# EAGLE design MPPT_Charger_12A (EAGLE 7.6.0)

## Sheet 1 of 2
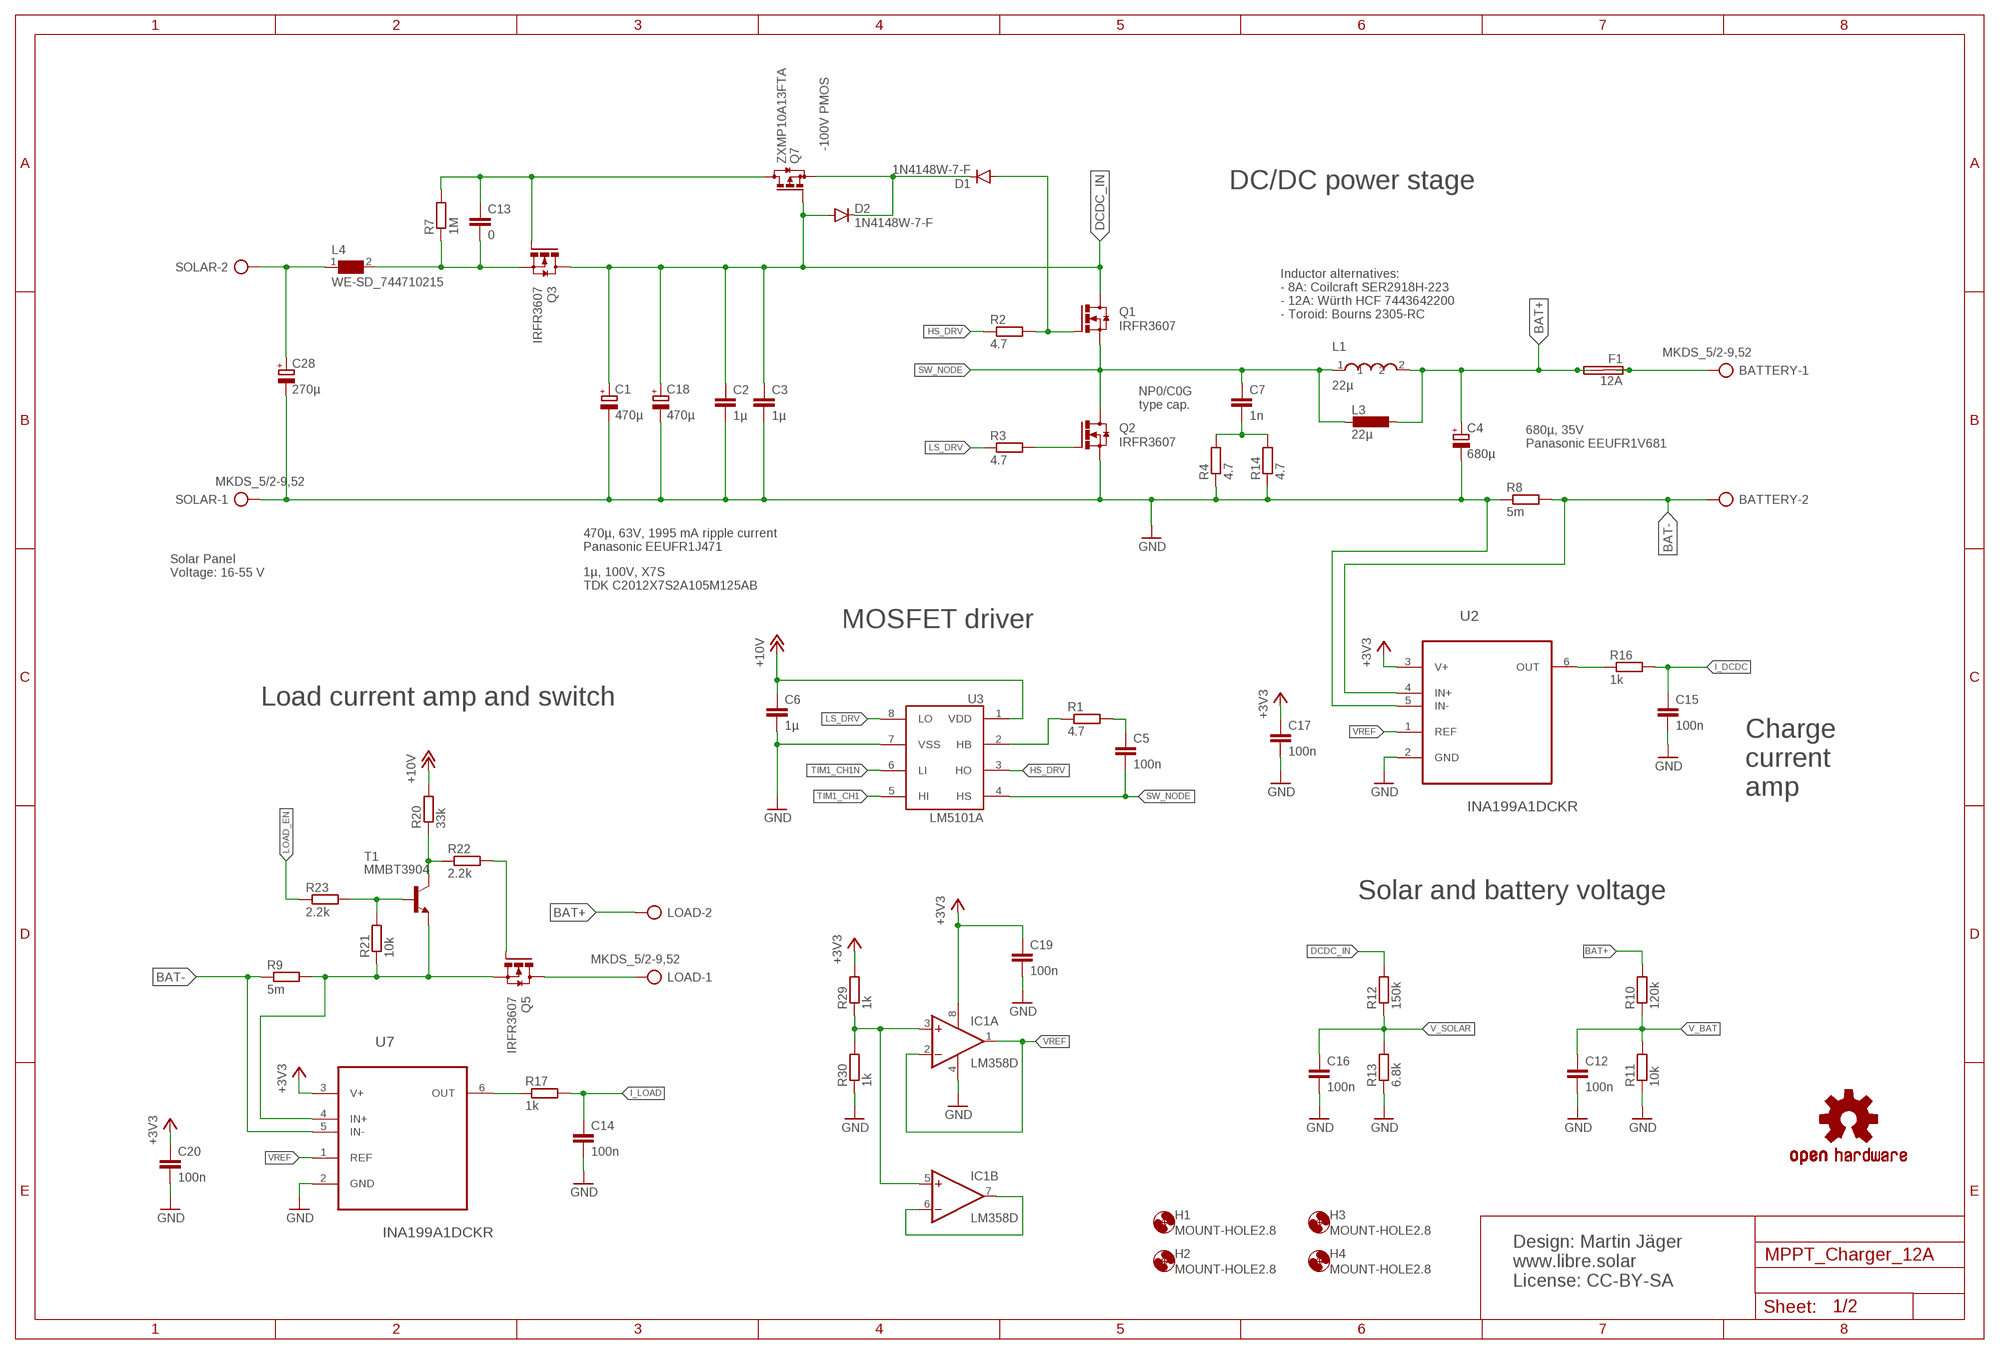
[diagram p0: schematic, sheet 1]

### Parts
BATTERY  MKDS_5/2-9,52  [MKDS_5/2-952]
C1  470µ  CPOL-EUE5-13  [E5-13]
C2  1µ  C-EUC0805  [C0805]
C3  1µ  C-EUC0805  [C0805]
C4  680µ  CPOL-EUE5-10.5  [E5-10,5]
C5  100n  C-EUC0603  [C0603]
C6  1µ  C-EUC0603  [C0603]
C7  1n  C-EUC0805  [C0805]
C12  100n  C-EUC0603  [C0603]
C13  0  C-EUC0603  [C0603]
C14  100n  C-EUC0603  [C0603]
C15  100n  C-EUC0603  [C0603]
C16  100n  C-EUC0603  [C0603]
C17  100n  C-EUC0603  [C0603]
C18  470µ  CPOL-EUE5-13  [E5-13]
C19  100n  C-EUC0603  [C0603]
C20  100n  C-EUC0603  [C0603]
C28  270µ  CPOL-EUE5-10.5  [E5-10,5]
D1  1N4148W-7-F  DIODESOD123  [SOD-123]
D2  1N4148W-7-F  DIODESOD123  [SOD-123]
F1  12A  FUSE_BLADE_STD  [BLADE_FUSE_STD]
H1  MOUNT-HOLE2.8  [2,8]
H2  MOUNT-HOLE2.8  [2,8]
H3  MOUNT-HOLE2.8  [2,8]
H4  MOUNT-HOLE2.8  [2,8]
IC1  LM358D  [SO08]
L1  22µ  WE-HCF_2818_7443643300  [WE-HCF_2818_7443643300]
L3  22µ  L-BOURNS2300-H  [L-BOURNS-2300-H]
L4  WE-SD_744710215  [WE-SD_744710215]
LOAD  MKDS_5/2-9,52  [MKDS_5/2-952]
N1  OSHW-LOGOM  [OSHW-LOGO-M]
Q1  IRFR3607  MOSFET_N_DPAK  [DPAK]
Q2  IRFR3607  MOSFET_N_DPAK  [DPAK]
Q3  IRFR3607  MOSFET_N_DPAK  [DPAK]
Q5  IRFR3607  MOSFET_N_DPAK  [DPAK]
Q7  ZXMP10A13FTA  BSS84  [SOT23]
R1  4.7  R-EU_R0805  [R0805]
R2  4.7  R-EU_R0805  [R0805]
R3  4.7  R-EU_R0805  [R0805]
R4  4.7  R-EU_R1206  [R1206]
R7  1M  R-EU_R0603  [R0603]
R8  5m  R-EU_R2512  [R2512]
R9  5m  R-EU_R2512  [R2512]
R10  120k  R-EU_R0603  [R0603]
R11  10k  R-EU_R0603  [R0603]
R12  150k  R-EU_R0603  [R0603]
R13  6.8k  R-EU_R0603  [R0603]
R14  4.7  R-EU_R1206  [R1206]
R16  1k  R-EU_R0603  [R0603]
R17  1k  R-EU_R0603  [R0603]
R20  33k  R-EU_R0603  [R0603]
R21  10k  R-EU_R0603  [R0603]
R22  2.2k  R-EU_R0603  [R0603]
R23  2.2k  R-EU_R0603  [R0603]
R29  1k  R-EU_R0603  [R0603]
R30  1k  R-EU_R0603  [R0603]
SOLAR  MKDS_5/2-9,52  [MKDS_5/2-952]
T1  MMBT3904  MMBT3904LT1-NPN-SOT23-BEC  [SOT23-BEC]
U2  INA199A1DCKR  [SOT65P210X110-6N]
U3  LM5101A  [SOIC-8-N]
U7  INA199A1DCKR  [SOT65P210X110-6N]

### Nets
+3V3: C17.1 C19.1 C20.1 IC1.8(P:V+) R29.2 U2.3(V+) U7.3(V+) ; also sheet 2
+10V [VIN]: C6.1 R20.2 U3.1(VDD) ; also sheet 2
BAT+ [VIN]: C4.+ F1.P$3(2A) F1.P$4(2B) L1.2 L3.P$1 LOAD.2 R10.2 ; also sheet 2
BAT-: BATTERY.2 R8.2 R9.1 U2.4(IN+) U7.5(IN-)
BAT-1: Q5.3(S) R9.2 R21.1 T1.E U7.4(IN+)
DCDC_IN: C1.+ C2.1 C3.1 C18.+ D2.A Q1.4(D) Q3.4(D) Q7.1(G) R12.2
FUSE+ [VIN]: BATTERY.1 F1.P$1(1A) F1.P$2(1B)
GND: C1.- C2.2 C3.2 C4.- C6.2 C12.2 C14.2 C15.2 C16.2 C17.2 C18.- C19.2 C20.2 C28.- IC1.4(P:V-) Q2.3(S) R4.1 R8.1 R11.1 R13.1 R14.1 R30.1 SOLAR.1 U2.2(GND) U2.5(IN-) U3.7(VSS) U7.2(GND) ; also sheet 2
HS_DRV: R2.1 U3.3(HO)
I_DCDC: C15.1 R16.2 ; also sheet 2
I_LOAD: C14.1 R17.2 ; also sheet 2
LC_OUT: C13.2 L4.2 Q3.3(S) R7.1
LOAD-: LOAD.1 Q5.4(D)
LOAD_EN: R23.1 ; also sheet 2
LOAD_G: Q5.1(G) R22.2
LS_DRV: R3.1 U3.8(LO)
N$1: R1.1 U3.2(HB)
N$2: C5.1 R1.2
N$4: D1.A Q1.1(G) R2.2
N$6: IC1.6(B:-IN) IC1.7(B:OUT)
N$8: C13.1 Q3.1(G) Q7.3(D) R7.2
N$9: Q2.1(G) R3.2
N$10: D1.C D2.C Q7.2(S)
N$11: R20.1 R22.1 T1.C
N$12: C7.2 R4.2 R14.2
N$18: R16.1 U2.6(OUT)
N$19: IC1.3(A:+IN) IC1.5(B:+IN) R29.1 R30.2
N$20: R17.1 U7.6(OUT)
N$24: R21.2 R23.2 T1.B
SOLAR+: C28.+ L4.1 SOLAR.2
SW_NODE: C5.2 C7.1 L1.1 L3.P$2 Q1.3(S) Q2.4(D) U3.4(HS)
TIM1_CH1: U3.5(HI) ; also sheet 2
TIM1_CH1N: U3.6(LI) ; also sheet 2
V_BAT: C12.1 R10.1 R11.2 ; also sheet 2
V_SOLAR: C16.1 R12.1 R13.2 ; also sheet 2
VREF: IC1.1(A:OUT) IC1.2(A:-IN) U2.1(REF) U7.1(REF)

### Notes on the sheet
- -100V PMOS
- DC/DC power stage
- Inductor alternatives:
  - 8A: Coilcraft SER2918H-223
  - 12A: Würth HCF 7443642200
  - Toroid: Bourns 2305-RC
- NP0/C0G
  type cap.
- 680µ, 35V
  Panasonic EEUFR1V681
- 470µ, 63V, 1995 mA ripple current
  Panasonic EEUFR1J471
- Solar Panel
  Voltage: 16-55 V
- 1µ, 100V, X7S
  TDK C2012X7S2A105M125AB
- MOSFET driver
- Load current amp and switch
- Charge
  current
  amp
- Solar and battery voltage
- Design: Martin Jäger
  www.libre.solar
  License: CC-BY-SA

## Sheet 2 of 2
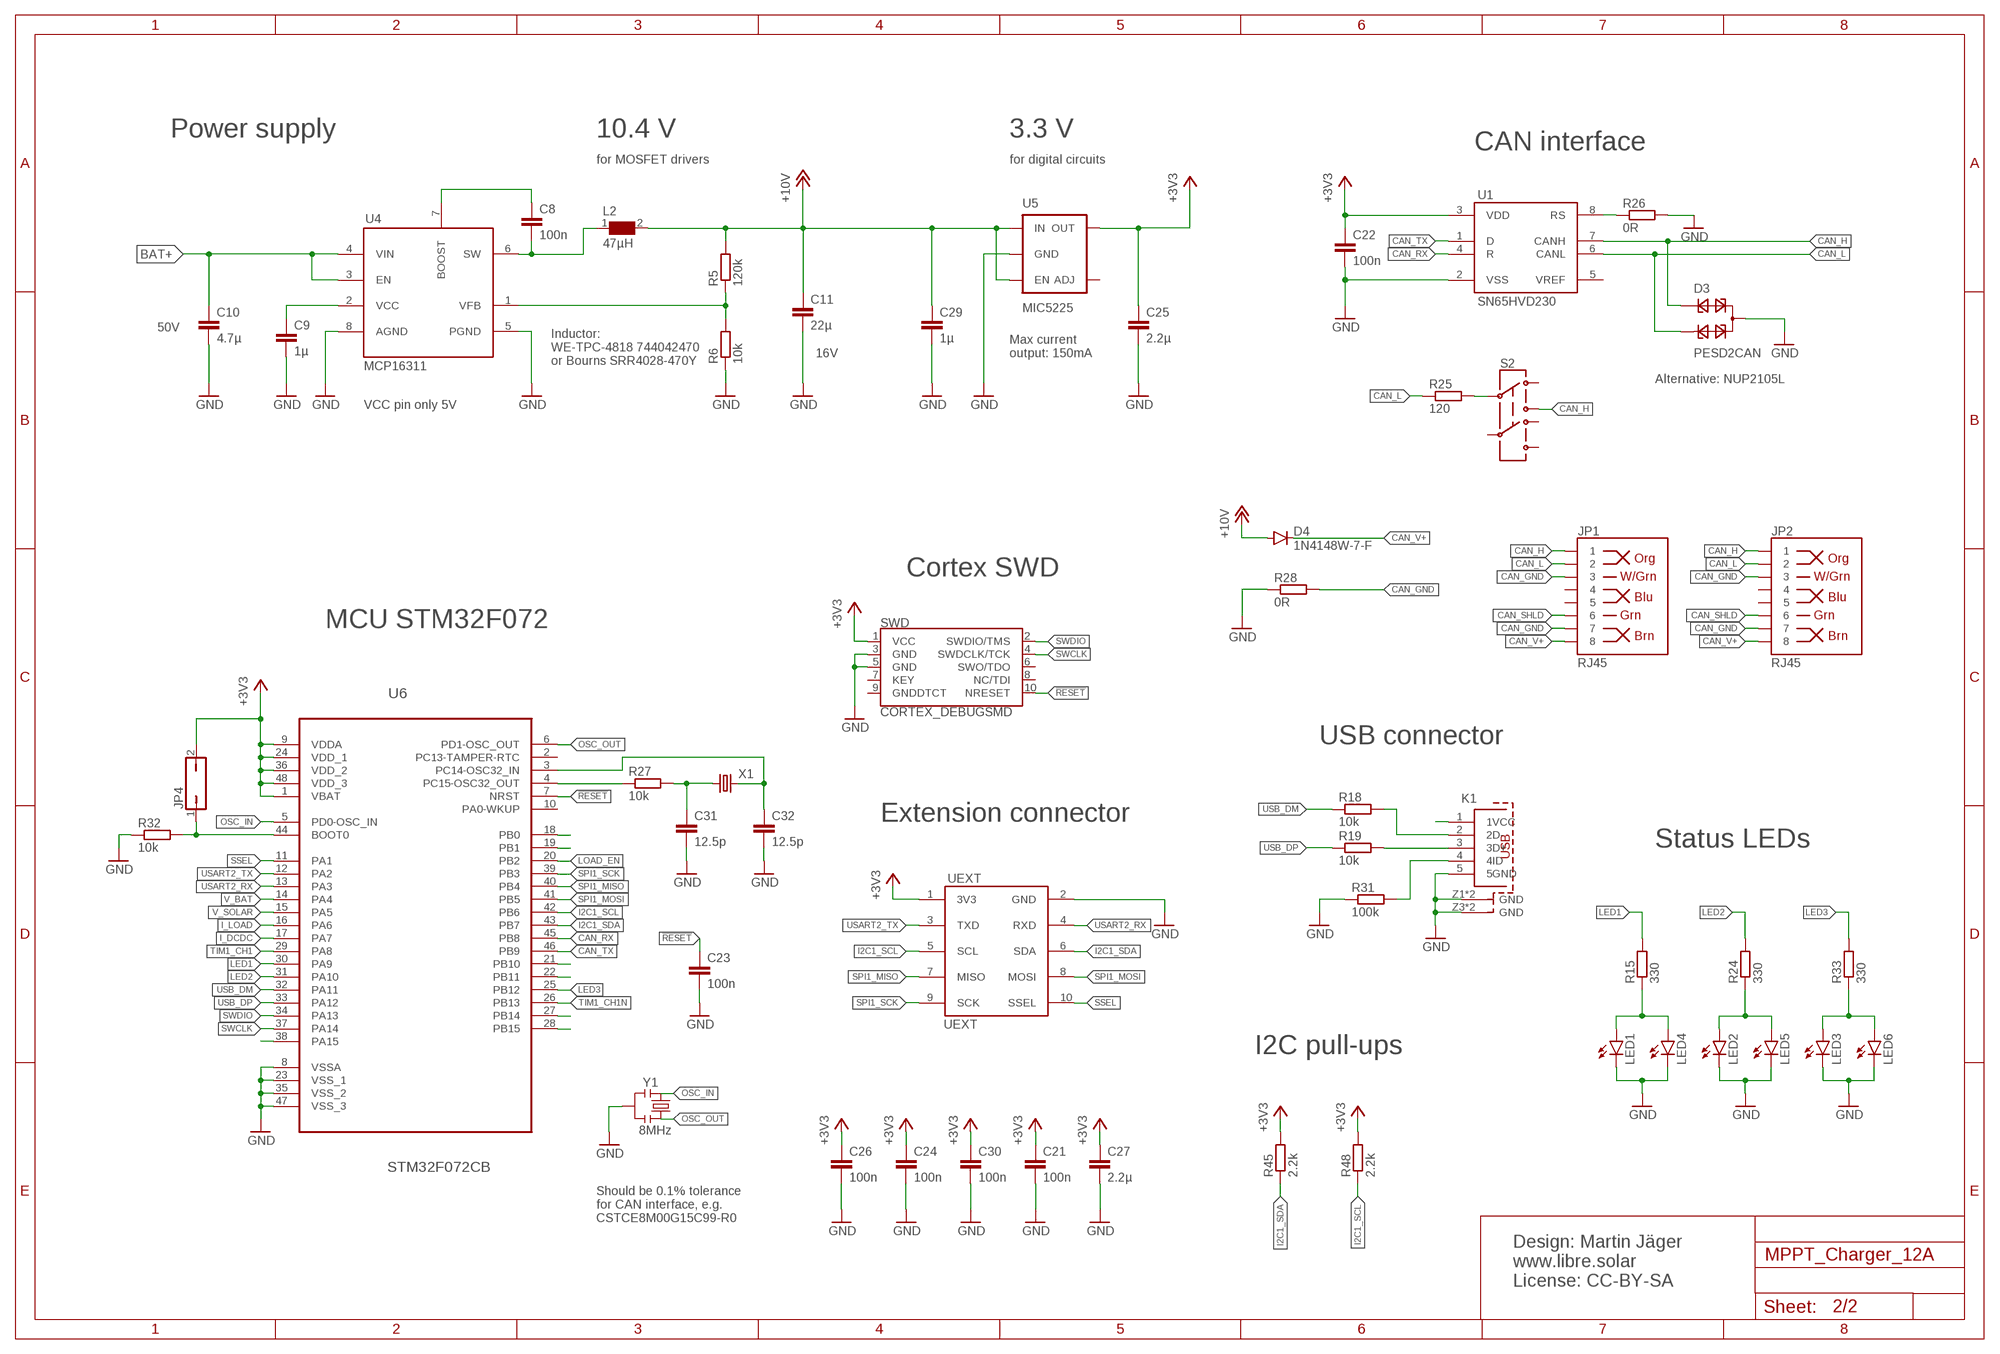
[diagram p1: schematic, sheet 2]

### Parts
C8  100n  C-EUC0603  [C0603]
C9  1µ  C-EUC0603  [C0603]
C10  4.7µ  C-EUC1210  [C1210]
C11  22µ  C-EUC1210  [C1210]
C21  100n  C-EUC0603  [C0603]
C22  100n  C-EUC0603  [C0603]
C23  100n  C-EUC0603  [C0603]
C24  100n  C-EUC0603  [C0603]
C25  2.2µ  C-EUC0603  [C0603]
C26  100n  C-EUC0603  [C0603]
C27  2.2µ  C-EUC0603  [C0603]
C29  1µ  C-EUC0603  [C0603]
C30  100n  C-EUC0603  [C0603]
C31  12.5p  C-EUC0603  [C0603]
C32  12.5p  C-EUC0603  [C0603]
D3  PESD2CAN  [SOT23]
D4  1N4148W-7-F  DIODESOD123  [SOD-123]
JP1  RJ45  RJ45-8PTH  [RJ45-8]
JP2  RJ45  RJ45-8PTH  [RJ45-8]
JP4  JP1Q  [JP1]
K1  629105150521  [629105150521]
L2  47µH  WE-TPC_4818/4828  [WE-TPC_4818/4828]
LED1  LED3MM  [LED3MM]
LED2  LED3MM  [LED3MM]
LED3  LED3MM  [LED3MM]
LED4  LED0603  [LED-0603]
LED5  LED0603  [LED-0603]
LED6  LED0603  [LED-0603]
R5  120k  R-EU_R0603  [R0603]
R6  10k  R-EU_R0603  [R0603]
R15  330  R-EU_R0603  [R0603]
R18  10k  R-EU_R0603  [R0603]
R19  10k  R-EU_R0603  [R0603]
R24  330  R-EU_R0603  [R0603]
R25  120  R-EU_R1206  [R1206]
R26  0R  R-EU_R0603  [R0603]
R27  10k  R-EU_R0603  [R0603]
R28  0R  R-EU_R0603  [R0603]
R31  100k  R-EU_R0603  [R0603]
R32  10k  R-EU_R0603  [R0603]
R33  330  R-EU_R0603  [R0603]
R45  2.2k  R-EU_R0603  [R0603]
R48  2.2k  R-EU_R0603  [R0603]
S2  SWITCH-DPDT_CK_JS  [SWITCH-CK_JS_THT]
SWD  CORTEX_DEBUGSMD  [SAMTECH_FTSH-105-01]
U1  SN65HVD230  [SOIC-8-N]
U4  MCP16311  [MSOP8]
U5  MIC5225  V_REG_MIC5235  [SOT23-5]
U6  STM32F072CB  [QFP50P900X900X160-48N]
UEXT  UEXT  [UEXT]
X1  CRYSTALMM20SS  [MM20SS]
Y1  8MHz  RESONATOR1:1  [RESONATOR-SMD-1:1]

### Nets
!RESET: C23.1 SWD.10(NRESET) U6.7(NRST)
+3V3: C21.1 C22.1 C24.1 C25.1 C26.1 C27.1 C30.1 JP4.2 R45.2 R48.2 SWD.1(VCC) U1.3(VDD) U5.5(OUT) U6.1(VBAT) U6.9(VDDA) U6.24(VDD_1) U6.36(VDD_2) U6.48(VDD_3) UEXT.1(3V3) ; also sheet 1
+10V [VIN]: C11.1 C29.1 D4.A L2.2 R5.2 U5.1(IN) U5.3(EN) ; also sheet 1
BAT+ [VIN]: C10.1 U4.3(EN) U4.4(VIN) ; also sheet 1
CAN_GND: JP1.3 JP1.7 JP2.3 JP2.7 R28.2
CAN_H: D3.1 JP1.1 JP2.1 S2.P$3 U1.7(CANH)
CAN_L: D3.2 JP1.2 JP2.2 R25.1 U1.6(CANL)
CAN_RX: U1.4(R) U6.45(PB8)
CAN_SHLD: JP1.6 JP2.6
CAN_TX: U1.1(D) U6.46(PB9)
CAN_V+: D4.C JP1.8 JP2.8
GND: C9.2 C10.2 C11.2 C21.2 C22.2 C23.2 C24.2 C25.2 C26.2 C27.2 C29.2 C30.2 C31.2 C32.2 D3.3 K1.5(5GND) K1.Z1(GND) K1.Z2(GND) K1.Z3(GND) K1.Z4(GND) LED1.K(C) LED2.K(C) LED3.K(C) LED4.C LED5.C LED6.C R6.1 R26.2 R28.1 R31.1 R32.1 SWD.3(GND) SWD.5(GND) U1.2(VSS) U4.5(PGND) U4.8(AGND) U5.2(GND) U6.8(VSSA) U6.23(VSS_1) U6.35(VSS_2) U6.47(VSS_3) UEXT.2(GND) Y1.2 ; also sheet 1
I2C1_SCL: R48.1 U6.42(PB6) UEXT.5(SCL)
I2C1_SDA: R45.1 U6.43(PB7) UEXT.6(SDA)
I_DCDC: U6.17(PA7) ; also sheet 1
I_LOAD: U6.16(PA6) ; also sheet 1
LED1: R15.2 U6.30(PA9)
LED2: R24.2 U6.31(PA10)
LED3: R33.2 U6.25(PB12)
LOAD_EN: U6.20(PB2) ; also sheet 1
N$3: R26.1 U1.8(RS)
N$5: R25.2 S2.P$2
N$7: R27.1 U6.4(PC15-OSC32_OUT)
N$13: C8.2 L2.1 U4.6(SW)
N$14: C8.1 U4.7(BOOST)
N$15: C31.1 R27.2 X1.1
N$16: C9.1 U4.2(VCC)
N$17: C32.1 U6.3(PC14-OSC32_IN) X1.4
N$21: U6.28(PB15)
N$22: R5.1 R6.2 U4.1(VFB)
N$25: U6.21(PB10)
N$26: U6.22(PB11)
N$27: K1.2(2D-) R18.2
N$28: K1.3(3D+) R19.2
N$29: K1.4(4ID) R31.2
N$30: JP4.1 R32.2 U6.44(BOOT0)
N$32: U6.19(PB1)
N$34: U6.18(PB0)
N$35: LED3.A LED6.A R33.1
N$37: K1.1(1VCC)
N$43: LED1.A LED4.A R15.1
N$46: LED2.A LED5.A R24.1
N$49: U6.27(PB14)
N$51: U6.38(PA15)
OSC_IN: U6.5(PD0-OSC_IN) Y1.1
OSC_OUT: U6.6(PD1-OSC_OUT) Y1.3
SPI1_MISO: U6.40(PB4) UEXT.7(MISO)
SPI1_MOSI: U6.41(PB5) UEXT.8(MOSI)
SPI1_SCK: U6.39(PB3) UEXT.9(SCK)
SSEL: U6.11(PA1) UEXT.10(SSEL)
SWCLK: SWD.4(SWDCLK/TCK) U6.37(PA14)
SWDIO: SWD.2(SWDIO/TMS) U6.34(PA13)
TIM1_CH1: U6.29(PA8) ; also sheet 1
TIM1_CH1N: U6.26(PB13) ; also sheet 1
USART2_RX: U6.13(PA3) UEXT.4(RXD)
USART2_TX: U6.12(PA2) UEXT.3(TXD)
USB_DM: R18.1 U6.32(PA11)
USB_DP: R19.1 U6.33(PA12)
V_BAT: U6.14(PA4) ; also sheet 1
V_SOLAR: U6.15(PA5) ; also sheet 1
Unconnected: JP1.4 JP1.5 JP2.4 JP2.5 S2.P$1 S2.P$4 S2.P$5 S2.P$6 SWD.6(SWO/TDO) SWD.7(KEY) SWD.8(NC/TDI) SWD.9(GNDDTCT) U1.5(VREF) U5.4(ADJ) U6.2(PC13-TAMPER-RTC) U6.10(PA0-WKUP)

### Notes on the sheet
- Power supply | 10.4 V | 3.3 V
- CAN interface
- for MOSFET drivers | for digital circuits
- 50V
- 16V
- Max current 
  output: 150mA
- Inductor:
  WE-TPC-4818 744042470
  or Bourns SRR4028-470Y
- Alternative: NUP2105L
- VCC pin only 5V
- Cortex SWD
- MCU STM32F072
- USB connector
- Extension connector
- Status LEDs
- I2C pull-ups
- Should be 0.1% tolerance
  for CAN interface, e.g.
  CSTCE8M00G15C99-R0
- Design: Martin Jäger
  www.libre.solar
  License: CC-BY-SA

## Library data of the parts
BATTERY LOAD SOLAR = resolut:MKDS_5/2-: MKDS 5/2-6,35 Source: PHOENIX CONTACT; OC_FARNELL: unknown
C1 C18 = rcl:CPOL-EU: POLARIZED CAPACITOR, European symbol; MF: PANASONIC ELECTRONIC COMPONENTS; MPN: EEUFR1J471B; OC_FARNELL: 2079308
C2 C3 = rcl:C-EU: CAPACITOR, European symbol; MF: TDK; MPN: C2012X7S2A105M125AB; OC_FARNELL: 2528783
C4 = rcl:CPOL-EU: POLARIZED CAPACITOR, European symbol; MF: PANASONIC ELECTRONIC COMPONENTS; MPN: EEUFR1V681LB; OC_FARNELL: 1800669
C5 C8 C12 C14-C17 C19-C21 C23 C24 C26 C30-C32 = rcl:C-EU: CAPACITOR, European symbol; MF: MURATA; MPN: GRM188R71H104KA93D; OC_FARNELL: 8820023
C6 C9 C13 C29 = rcl:C-EU: CAPACITOR, European symbol; MF: AVX; MPN: 08055C104KAT2A; OC_FARNELL: 499687
C7 = rcl:C-EU: CAPACITOR, European symbol; MF: MULTICOMP; MPN: MCU0805C102JCT; OC_FARNELL: 9406212
C10 = rcl:C-EU: CAPACITOR, European symbol; MF: MURATA; MPN: GRM31CR71H475KA12L; OC_FARNELL: 1735545
C11 = rcl:C-EU: CAPACITOR, European symbol; MF: MULTICOMP; MPN: MC1210B226M160CT; OC_FARNELL: 2320948
C22 = rcl:C-EU: CAPACITOR, European symbol; MF: AVX; MPN: 06035C104KAT2A; OC_FARNELL: 1301804
C25 C27 = rcl:C-EU: CAPACITOR, European symbol; MF: AVX; MPN: 0805YC475KAT2A; OC_FARNELL: 1657937
C28 = rcl:CPOL-EU: POLARIZED CAPACITOR, European symbol; MF: PANASONIC ELECTRONIC COMPONENTS; MPN: EEUFR1J271LB; OC_FARNELL: 2079304
D1 D2 D4 = SparkFun-DiscreteSemi:DIODE: Diode These are standard reverse protection diodes and small signal diodes. SMA package can handle up to about 1A. SOD-323 can handle about 200mA. What the SOD-323 package when ordering, there are some mfgs out there that are 5-pin packages.; MF: MULTICOMP; MPN: 1N4148W; OC_FARNELL: 1621821
D3 = LibreSolar:PESD2CAN: CAN bus ESD protection diode Source: http://www.nxp.com/documents/data_sheet/PESD1CAN.pdf; MF: NXP; MPN: PESD2CAN; OC_FARNELL: 1510712
F1 = LibreSolar:FUSE: FUSE HOLDER 5 x 20 mm, SH contact, E1207 Buerklin 64G6061; MF: KEYSTONE; MPN: 3522-2; OC_FARNELL: 1608220
H1-H4 = holes:MOUNT-HOLE: MOUNTING HOLE with drill center marker; OC_FARNELL: unknown
IC1 = linear:LM358: OP AMP also LM158; LM258; LM2904 Source: http://cache.national.com/ds/LM/LM158.pdf
JP1 JP2 = SparkFun-Connectors:RJ45-8: RJ45 Jack Simple RJ45, 8-pin connection - connector for common Cat5, Cat5e, and Cat6 Ethernet cables. Footprint not yet proven in production. Connector sku is PRT-00643; Breakout PCB sku is BOB-00716.; MF: AMPHENOL COMMERCIAL PRODUCTS; MPN: RJHSE-5080; OC_FARNELL: 1860577; PROD_ID: CONN-08506
JP4 = jumper:JP1Q: JUMPER
K1 = Input-Output_Connectors_rev15d:629105150521: WR-COM_USB_Micro Type B_Horizontal_SMT ; Micro Type B Horizontal SMT - 3A current at Pin1 & Pin 5 - with Pegs and THT shielding Pins - T&R Packaging Code : Con_I-O_COM_USB_2.0_B_629105150521_629105150521 <http://katalog.we-online.de/media/images/eican/Con_I-O_COM_USB_2.0_B_629105150521_pf2.jpg> Details see: http://katalog.we-online.de/em/datasheet/629105150521.pdf Created 12/08/2014, Dan Xu 2014 (C) Wurth Elektronik
L1 = PowerMagnetics:WE-HCF_2818_7443643300: SMD High Current Inductor -Saturation current up to 75A -Very low core losses(MnZn) -Magnetically shielded -Operating temprature:-40°Cto 125°C -Current capability up to 32A --Storage inductor for high efficiency DC/DC converters --Single and polyphase buck converters --Filter for audio applications --Optimized for high current boost applications <http://katalog.we-online.de/media/images/eisos/IndHCF_pf2.jpg> Details see: http://katalog.we-online.de/en/pbs/WE-HCF Created by Dan Xu 2014-07-14 2014 (C) Würth Elektronik; MF: COILCRAFT; MPN: SER2918H-223KL; OC_FARNELL: 2288918
L2 = PowerMagnetics:WE-TPC: Shielded Tiny Power Inductor WE-TPC - Extremely flat power inductor - High current capability - High reliability and perfect soldering characteristics because of integrated soldering pad - magnetically shielded -- Portable power like PDA, digital camera, PCMICA-cards and displays -- DC/DC-converter -- Recommended for switching regulator IC's from Linear Technology, National Semiconductor, Texas Instruments and Fairchild Semiconductor <http://katalog.we-online.de/media/images/eisos/IndTPC_pf2.jpg> Details see: http://katalog.we-online.de/en/pbs/WE-TPC? Updated by Dan Xu 2014-07-11 2014 (C) Würth Elektronik; MF: WURTH ELEKTRONIK; MPN: 744043470; OC_FARNELL: 1890607
L3 = LibreSolar:L-BOURNS2300: Bourns High Current Toroid Inductor (2300 Series) Hole fits for largest wire diameter, e.g. Part Number 2305-RC: 22 uH, 16.4 A; MF: BOURNS; MPN: 2305-V-RC; OC_FARNELL: 1929755
L4 = PowerMagnetics:WE-SD: Leaded Wire Wound Rodcore Inductor WE-SD HIGH CURRENT - Rated Current up to 20 A - Inductance is independent from rated DC current - Mechanical dimensions can be adjusted on customer request - High mechanical stability -- Swirching regulators -- Motors -- Power amplifiers -- Power supplies -- Especially designed for automotive industry -- Broadband filtering <http://katalog.we-online.de/media/images/eisos/IndSD_pf2.jpg.jpg> Details see: http://katalog.we-online.de/en/pbs/WE-SD? Updated by Dan Xu 2014-07-11 2014 (C) Würth Elektronik; MF: WURTH ELEKTRONIK; MPN: 744710215; OC_FARNELL: 1635814
LED1-LED6 = SparkFun-LED:LED: LEDs Standard schematic elements and footprints for 5mm, 3mm, 1206, and 0603 sized LEDs. 5mm - Spark Fun Electronics SKU : COM-00529 (and others); OC_FARNELL: unknown
N1 = resolut:OSHW-LOGO: Open Source Hardware Logo This logo indicates the piece of hardware it is found on incorporates a OSHW license and/or adheres to the definition of open source hardware found here: http://freedomdefined.org/OSHW; OC_FARNELL: unknown
Q1-Q3 Q5 = LibreSolar:MOSFET_N; MF: INTERNATIONAL RECTIFIER; MPN: IRFR3607TRPBF; OC_FARNELL: 2101420
Q7 = transistor-small-signal:BSS84: P-CHANNEL MOS FET; MF: DIODES INC.; MPN: ZXMP10A13FTA; OC_FARNELL: 1843777
R1-R3 = rcl:R-EU_: RESISTOR, European symbol; MF: BOURNS; MPN: CR0805-FX-1001ELF; OC_FARNELL: 2008380
R4 R14 = rcl:R-EU_: RESISTOR, European symbol; MF: YAGEO (PHYCOMP); MPN: RC1206FR-074R7L; OC_FARNELL: 9236600
R5 R10 = rcl:R-EU_: RESISTOR, European symbol; MF: YAGEO (PHYCOMP); MPN: RC0603FR-07120KL; OC_FARNELL: 9238735
R6 R11 R18 R19 R21 R27 R31 R32 = rcl:R-EU_: RESISTOR, European symbol; MF: YAGEO (PHYCOMP); MPN: RC0603FR-0710KL; OC_FARNELL: 9238603
R7 = rcl:R-EU_: RESISTOR, European symbol; MF: YAGEO (PHYCOMP); MPN: RC0603FR-071ML; OC_FARNELL: 9238840
R8 R9 = rcl:R-EU_: RESISTOR, European symbol; MF: BOURNS; MPN: CRF2512-FX-R005ELF; OC_FARNELL: 2008327
R12 = rcl:R-EU_: RESISTOR, European symbol; MF: YAGEO (PHYCOMP); MPN: RC0603FR-07150KL; OC_FARNELL: 9238743
R13 = rcl:R-EU_: RESISTOR, European symbol; MF: YAGEO (PHYCOMP); MPN: RC0603FR-076K8L; OC_FARNELL: 9238581
R15 R24 R33 = rcl:R-EU_: RESISTOR, European symbol; MF: YAGEO (PHYCOMP); MPN: RC0603FR-07330RL; OC_FARNELL: 9238425
R16 R17 R29 R30 = rcl:R-EU_: RESISTOR, European symbol; MF: YAGEO (PHYCOMP); MPN: RC0603FR-071KL.; OC_FARNELL: 9238484
R20 = rcl:R-EU_: RESISTOR, European symbol; MF: YAGEO (PHYCOMP); MPN: RC0603FR-0733KL; OC_FARNELL: 9238662
R22 R23 R45 R48 = rcl:R-EU_: RESISTOR, European symbol; MF: YAGEO (PHYCOMP); MPN: RC0603FR-072K2L.; OC_FARNELL: 9238522
R25 = rcl:R-EU_: RESISTOR, European symbol; MF: WELWYN; MPN: WCR0805-120RFI; OC_FARNELL: 1100308
R26 R28 = rcl:R-EU_: RESISTOR, European symbol; MF: PANASONIC ELECTRONIC COMPONENTS; MPN: ERJ3GEY0R00V; OC_FARNELL: 2059527
S2 = LibreSolar:SWITCH-DPDT: DPDT Version of the COM-00597; MF: C & K COMPONENTS; MPN: JS202011CQN; OC_FARNELL: 2320018
SWD = LibreSolar:CORTEX_DEBUG: Cortex Debug Connector Datasheet <http://infocenter.arm.com/help/topic/com.arm.doc.faqs/attached/13634/cortex_debug_connectors.pdf>
T1 = transistor:*-NPN-: NPN Transistror BF959 corrected 2008.03.06; MF: DIODES INC.; MPN: MMBT3904-7-F; OC_FARNELL: 1773602
U1 = LibreSolar:SN65HVD230: 3.3V CAN transceiver; MF: TEXAS INSTRUMENTS; MPN: SN65HVD230DR; OC_FARNELL: 8452148
U2 U7 = Texas Instruments_By_element14_Batch_1:INA199A1DCKR: CURRENT SHUNT MONITOR; MPN: INA199A1DCKR; OC_FARNELL: -; OC_NEWARK: 74R6382; PACKAGE: SC70-6; SUPPLIER: Texas Instruments
U3 = LibreSolar:LM5101A; MF: TEXAS INSTRUMENTS; MPN: LM5101AM/NOPB; OC_FARNELL: 1559514
U4 = LibreSolar:MCP16311: 30V Input, 1A Output, High-Efficiency, Integrated Synchronous Switch Step-Down Regulator; MF: MICROCHIP; MPN: MCP16311-E/MS; OC_FARNELL: 2414134
U5 = SparkFun-PowerIC:V_REG_MIC5235; MF: MICROCHIP; MPN: MIC5225-3.3YM5-TR; OC_FARNELL: 2510262
U6 = LibreSolar:STM32F072CB: ARM-based 32-bit MCU; MPN: STM32F100C4T6B; OC_FARNELL: 1838504; OC_NEWARK: 86R1309; PACKAGE: LQFP-48; SUPPLIER: STMircroelectronics
UEXT = LibreSolar:UEXT: WR-BHD 2.54mm Male Box Header, 10 Pins=>Code : Con_WTB_BHD_2.54_Male_THT_WS_61201021621 <http://katalog.we-online.de/media/thumbs2/eican/thb_Con_WTB_BHD_2.54_Male_THT_WS_6120xx21621_pf2.jpg> Details see: http://katalog.we-online.de/en/em/612_0xx_216_21 Created 2014-06-04, Karrer Zheng 2014 (C) Würth Elektronik
X1 = crystal:CRYSTAL: CRYSTAL; OC_FARNELL: unknown; OC_NEWARK: unknown
Y1 = Testing:RESONATOR: Resonator Small SMD resonator. This is the itty bitty 10/20MHz resonators with built in caps. CSTCE10M0G55 and CSTCE20M0V53. Footprint for SMD has been used in SFE production for years, and does work okay. 1:1 is an attempt to get larger fillets on the sides so it will be easier to inspect these solders in our AOI machine. The pads have been minimized to match the actual metal under the resonator. To see this relation, it includes an image import of the bottom side of the component. Imported to scale on layer 200.; MF: MURATA; MPN: CSTCE8M00G55-R0; OC_FARNELL: 2443270

## Net classes
0 default: width 0.203 mm, drill 0.3 mm, clearance 0.152 mm
1 power: width 0.203 mm, drill 0.3 mm, clearance 0.152 mm
2 VIN: width 0.203 mm, drill 0.3 mm, clearance 0.152 mm

## Board
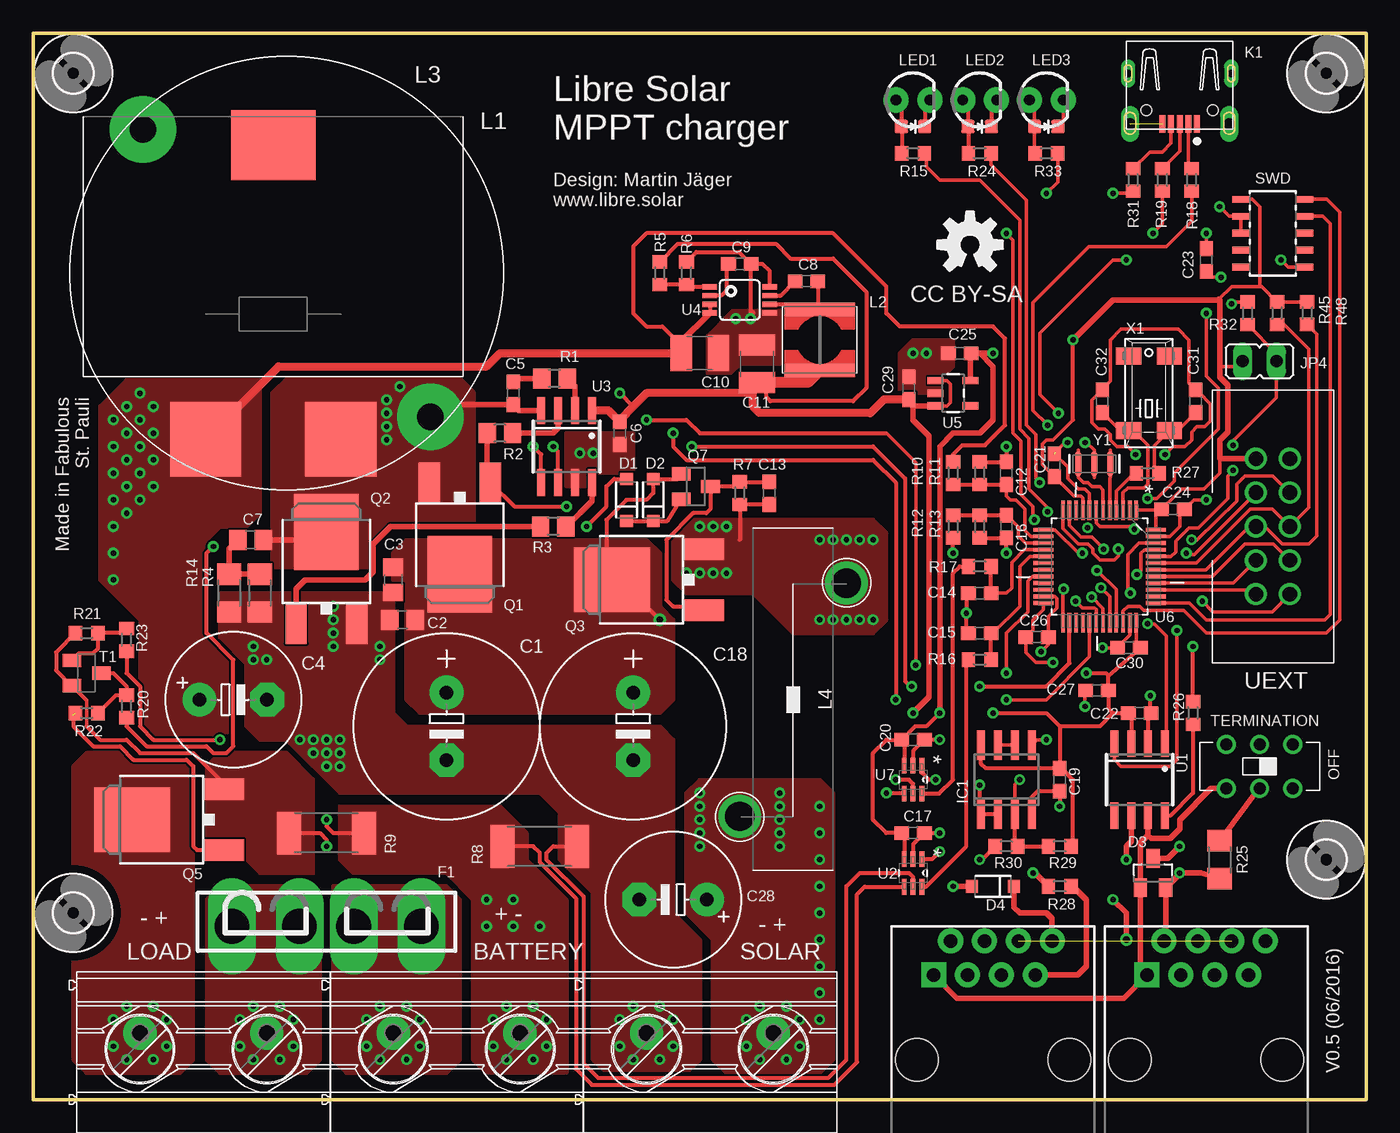
[diagram p2: board, top side]
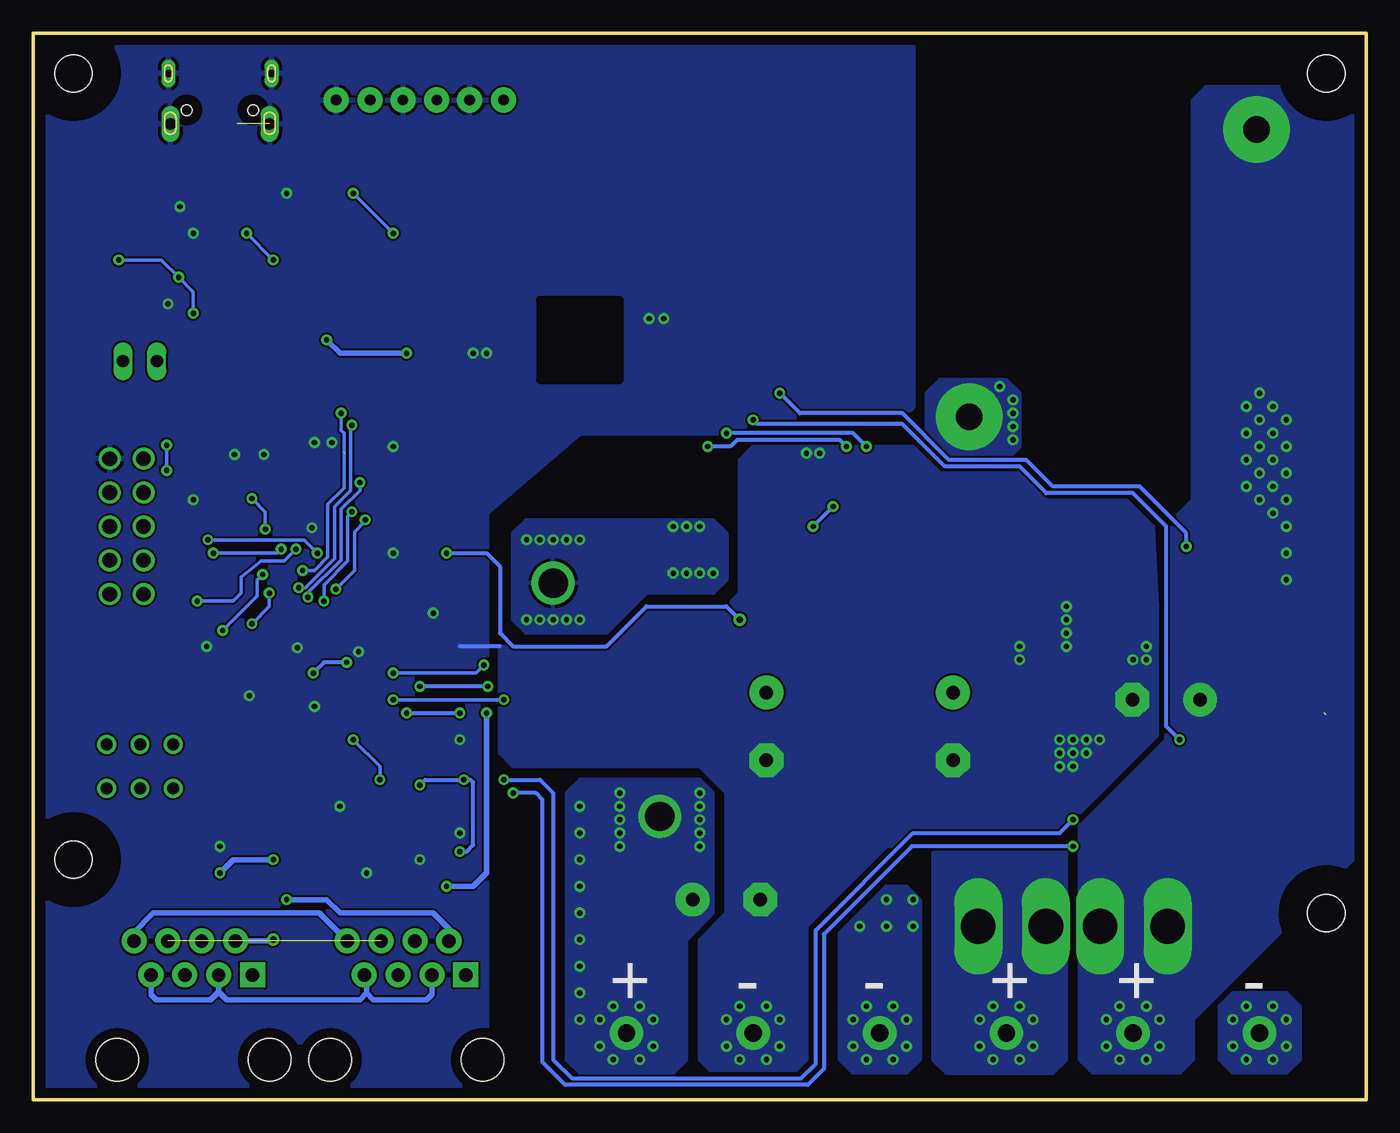
[diagram p3: board, bottom side, seen from below]

Size 100 x 80 mm. Coordinates in mm from the lower left corner, seen from the top.
Outline: 100,80 0,80 0,0 100,0 100,80
Copper layers (1*16): Top 0.035mm / dielectric 1.5mm / Bottom 0.035mm
Design rules "default *": minimum track width 8mil, minimum drill 0.3mm, track to track 6mil, track to pad 6mil, pad to pad 6mil, via to via 6mil, smd to smd 6mil, copper to edge 30mil, drill to drill 8mil, minimum pad ring 10mil, minimum via ring 8mil, stop-mask expansion 4mil, vias tented up to drill 0mil, thermal gap 10mil
bRestrict: area 56,54 to 62,60

### Footprints (pad centres in the part's own frame; a part is rotated, then mirrored left to right if it is on the bottom)
MKDS_5/2-952 = drill 1.3 pad 2.5: 1 0,0; 2 9.5,0
E5-13 = drill 1.016 pad 2.54: + -2.54,0 | drill 1.016 pad 2.54 octagon: - 2.54,0
C0805 = smd 1.3 x 1.5: 1 -0.95,0; 2 0.95,0
E5-10,5 = drill 1.016 pad 2.54: + -2.54,0 | drill 1.016 pad 2.54 octagon: - 2.54,0
C0603 = smd 1.1 x 1: 1 -0.85,0; 2 0.85,0
C1210 = smd 1.6 x 2.7: 1 -1.4,0; 2 1.4,0
SOD-123 = smd 0.9 x 0.95: A 1.575,0; C -1.575,0
SOT23 = smd 1 x 1.4: 1 -0.95,-1.1; 2 0.95,-1.1; 3 0,1.1
BLADE_FUSE_STD = drill 2.6 pad 3.1 long: P$1 -7.112,0; P$2 -2.032,0; P$3 2.032,0; P$4 7.112,0
2,8 = hole 2.8: 0,0
SO08 = smd 0.6 x 2.2: 1 -1.905,-2.6; 2 -0.635,-2.6; 3 0.635,-2.6; 4 1.905,-2.6; 5 1.905,2.6; 6 0.635,2.6; 7 -0.635,2.6; 8 -1.905,2.6
RJ45-8 = drill 1 pad 1.88 square: 1 -4.445,6.35 | drill 1 pad 1.88: 2 -3.175,8.89; 3 -1.905,6.35; 4 -0.635,8.89; 5 0.635,6.35; 6 1.905,8.89; 7 3.175,6.35; 8 4.445,8.89 | hole 3.2: -5.715,0; 5.715,0
JP1 = drill 0.914 long: 1 0,-1.27; 2 0,1.27
629105150521 = smd 0.45 x 1.3: 1 -1.3,3.8; 2 -0.65,3.8; 3 0,3.8; 4 0.65,3.8; 5 1.3,3.8 | drill 0.85 pad 1.2 long: Z1 -3.725,3.8; Z2 3.725,3.8 | drill 0.55 pad 0.9 long: Z3 3.875,0; Z4 -3.875,0 | hole 0.8: -2.5,2.75; 2.5,2.75
WE-HCF_2818_7443643300 = smd 5.33 x 5.59: 1 -5.075,14.465; 2 5.075,14.465 | smd 6.35 x 5.28: 3 0,-7.61
WE-TPC_4818/4828 = smd 1 x 5.3: 1 -2.3,0; 2 2.3,0
L-BOURNS-2300-H = drill 2 pad 5: P$1 -15.24,0; P$2 15.24,0
WE-SD_744710215 = drill 2.2: 1 -8.75,4; 2 8.75,-4
LED3MM = drill 0.813 pad 1.88: A -1.27,0; K 1.27,0
LED-0603 = smd 1 x 1: A 0,-0.877; C 0,0.877
DPAK = smd 1.6 x 3: 1 -2.28,-5.31; 3 2.28,-5.31 | smd 4.826 x 5.715: 4 0,1.588
R0805 = smd 1.3 x 1.5: 1 -0.95,0; 2 0.95,0
R1206 = smd 1.6 x 1.803: 1 -1.422,0; 2 1.422,0
R0603 = smd 1 x 1.1: 1 -0.85,0; 2 0.85,0
R2512 = smd 1.8 x 3.2: 1 -2.8,0; 2 2.8,0
SWITCH-CK_JS_THT = drill 0.9: P$1 -2.5,1.65; P$2 0,1.65; P$3 2.5,1.65; P$4 -2.5,-1.65; P$5 0,-1.65; P$6 2.5,-1.65
SAMTECH_FTSH-105-01 = smd 0.508 x 1.27: 1 -2.54,-2.413; 2 -2.54,2.413; 3 -1.27,-2.413; 4 -1.27,2.413; 5 0,-2.413; 6 0,2.413; 7 1.27,-2.413; 8 1.27,2.413; 9 2.54,-2.413; 10 2.54,2.413
SOT23-BEC = smd 1 x 1.4: B -0.95,-1.1; C 0,1.1; E 0.95,-1.1
SOIC-8-N = smd 0.6 x 2: 1 -1.905,-2.7; 2 -0.635,-2.7; 3 0.635,-2.7; 4 1.905,-2.7; 5 1.905,2.7; 6 0.635,2.7; 7 -0.635,2.7; 8 -1.905,2.7
SOT65P210X110-6N = smd 1.168 x 0.356: 1 -1.041,0.66; 2 -1.041,0; 3 -1.041,-0.66; 4 1.041,-0.66; 5 1.041,0; 6 1.041,0.66
MSOP8 = smd 0.4 x 1.1: 1 -0.975,-2.25; 2 -0.325,-2.25; 3 0.325,-2.25; 4 0.975,-2.25; 5 0.975,2.25; 6 0.325,2.25; 7 -0.325,2.25; 8 -0.975,2.25
SOT23-5 = smd 0.55 x 1.2: 1 -0.95,-1.3; 2 0,-1.3; 3 0.95,-1.3; 4 0.95,1.3; 5 -0.95,1.3
QFP50P900X900X160-48N = smd 1.473 x 0.279: 1 -4.216,2.743; 2 -4.216,2.261; 3 -4.216,1.753; 4 -4.216,1.245; 5 -4.216,0.762; 6 -4.216,0.254; 7 -4.216,-0.254; 8 -4.216,-0.762; 9 -4.216,-1.245; 10 -4.216,-1.753; 11 -4.216,-2.261; 12 -4.216,-2.743; 25 4.216,-2.743; 26 4.216,-2.261; 27 4.216,-1.753; 28 4.216,-1.245; 29 4.216,-0.762; 30 4.216,-0.254; 31 4.216,0.254; 32 4.216,0.762; 33 4.216,1.245; 34 4.216,1.753; 35 4.216,2.261; 36 4.216,2.743 | smd 0.279 x 1.473: 13 -2.743,-4.216; 14 -2.261,-4.216; 15 -1.753,-4.216; 16 -1.245,-4.216; 17 -0.762,-4.216; 18 -0.254,-4.216; 19 0.254,-4.216; 20 0.762,-4.216; 21 1.245,-4.216; 22 1.753,-4.216; 23 2.261,-4.216; 24 2.743,-4.216; 37 2.743,4.216; 38 2.261,4.216; 39 1.753,4.216; 40 1.245,4.216; 41 0.762,4.216; 42 0.254,4.216; 43 -0.254,4.216; 44 -0.762,4.216; 45 -1.245,4.216; 46 -1.753,4.216; 47 -2.261,4.216; 48 -2.743,4.216
UEXT = drill 1.1: 1 -1.27,5.08; 2 1.27,5.08; 3 -1.27,2.54; 4 1.27,2.54; 5 -1.27,0; 6 1.27,0; 7 -1.27,-2.54; 8 1.27,-2.54; 9 -1.27,-5.08; 10 1.27,-5.08
MM20SS = smd 1.27 x 1.88: 1 -2.794,-1.524; 2 2.794,-1.524; 3 2.794,1.524; 4 -2.794,1.524
RESONATOR-SMD-1:1 = smd 0.45 x 1.905: 1 -1.2,0; 2 0,0; 3 1.2,0

### Placement (x,y rotation side)
BATTERY  27,5 0 top
C1  31,28 270 top
C2  27.7,36 180 top
C3  27,39 270 top
C4  15,30 0 top
C5  36,53 270 top
C6  44,50 270 top
C7  16.3,42 180 top
C8  58,61.4 0 top
C9  53,62.7 0 top
C10  50,56 0 top
C11  54.3,55.2 90 top
C12  73,47 90 top
C13  55.2,45.5 270 top
C14  71,38 180 top
C15  71,35 180 top
C16  73,43 270 top
C17  66,20 0 top
C18  45,28 270 top
C19  77,24 270 top
C20  66,27 0 top
C21  76.6,47.6 90 top
C22  83,29 0 top
C23  88,63 90 top
C24  85.5,44.3 0 top
C25  69.5,56 180 top
C26  75.3,34.7 0 top
C27  79.8,30.7 180 top
C28  48,15 180 top
C29  65.69,53.37 90 top
C30  82.2,33.9 180 top
C31  87.2,52.4 90 top
C32  80.2,52.4 90 top
D1  44.5,45 90 top
D2  46.5,45 90 top
D3  84,17 0 top
D4  72,16 180 top
F1  22,13 180 top
H1  3,14 0 top
H2  3,77 0 top
H3  97,77 0 top
H4  97,18 0 top
IC1  73,24 0 top
JP1  72,3 0 top
JP2  88,3 0 top
JP4  92,55.4 90 top
K1  86,77 180 top
L1  18,64 180 top
L2  59,57 270 top
L3  19,62 315 top
L4  57,30 90 top
LED1  66,75 0 top
LED2  71,75 0 top
LED3  76,75 0 top
LED4  66,73 270 top
LED5  71,73 270 top
LED6  76,73 270 top
LOAD  8,5 0 top
N1  70.28,64.13 0 top
Q1  32,41 180 top
Q2  22,41 0 top
Q3  45,39 90 top
Q5  9,21 90 top
Q7  49.7,46 270 top
R1  39.1,54.1 180 top
R2  35,50 180 top
R3  39,43 180 top
R4  17,38 90 top
R5  47,62 90 top
R6  49,62 270 top
R7  53,45.5 90 top
R8  38,19 180 top
R9  22,20 180 top
R10  69,47 90 top
R11  71,47 270 top
R12  69,43 270 top
R13  71,43 90 top
R14  14.7,38 90 top
R15  66,71 0 top
R16  71,33 0 top
R17  71,40 0 top
R18  86.9,69 90 top
R19  84.7,69 90 top
R20  7,29.5 270 top
R21  4,35 0 top
R22  4,29 180 top
R23  7,34.5 90 top
R24  71,71 0 top
R25  89,18 90 top
R26  87,29 90 top
R27  83.6,47 0 top
R28  77,16 0 top
R29  77,19 0 top
R30  73,19 0 top
R31  82.5,69 90 top
R32  91.1,59 270 top
R33  76,71 0 top
R45  93.3,59 90 top
R48  95.56,59 90 top
S2  92,25 180 top
SOLAR  46,5 0 top
SWD  93,65 270 top
T1  4,32 270 top
U1  83,24 180 top
U2  66,17 270 top
U3  40,49 180 top
U4  53,60 270 top
U5  69,53 270 top
U6  80,40 270 top
U7  66,24 270 top
UEXT  93,43 0 top
X1  83.7,53 90 top
Y1  79.6,47.7 180 top

### Tracks (layer width: path | path; a pad name or v marks a point on that pad's centre or on a via)
!RESET  (via drill 0.4)
  Top 0.254: v93.6,63 94.14,62.46 SWD.10 | U6.7 79.75,43.25 80,43 82.4,43 v82.6,42.8 | v88,59 88,54.3 88.9,53.4 88.9,50.3 85.6,47 85.6,46.4 84.3,45.1 v83.6,45.1 | v89.1,61.7 88.45,61.7 C23.1
  Bottom 0.254: v93.6,63 90.4,63 v89.1,61.7 88,60.6 v88,59 | v83.6,45.1 82.6,44.1 v82.6,42.8
+3V3  (via drill 0.4)
  Top 0.254: U6.24 75.78,36.78 75,36 75,35.25 C26.1 74.45,33.55 75.2,32.8 v76.5,32.8 | C30.1 82.74,34.21 U6.36 | C24.1 84.57,44.22 U6.1 | C24.1 84.22,43.87 U6.48 | R48.2 R45.2 92.15,61 | 92.15,61 89.9,61 88.95,60.05 88.9,60 | 92.15,61 92,61.15 92,67 91.46,67.54 SWD.1 | 89,48.1 89,47 87.8,45.8 86.15,45.8 C24.1 | JP4.2 90.33,55 89,55 | U6.9 78.75,45.15 78.6,45.3 78.05,45.3 C21.1 75.7,47.65 75.7,49.2 76,49.5 76.5,49.5 78,51
  Top 0.305: C20.1 65.34,26.81 U7.3 | U2.3 65.34,19.81 C17.1 64,20 63,21 63,26 64,27 C20.1 | C19.1 71.45,24.85 71.1,25.2 IC1.8 | R29.2 78,19.15 78,24 77.15,24.85 | 77.15,24.85 C19.1 | 77.15,24.85 77,25 | v68,29 67,28 66.15,28 C20.1 | v72,29 76,29 77,28 | 77,28 C19.1 | 77,28 80,28 81,29 | 81,29 C22.1 82.36,28.79 U1.3 | 81,29 80.65,29.35 C27.1 80.65,31.8 | 80.65,31.8 C30.1 | v79,32 80.45,32 80.65,31.8 | 78,51 v78,57
  Top 0.406: C25.1 71,56 72,55 72,51 71,50 69,50 68,49 v68,29 | U5.5 70.3,55.95 C25.1 | v72,56 C25.1 | UEXT.1 arc-90 91.65,48.1 89,48.1 89,49.5 89.6,50.1 89.6,53.6 89,54.2 89,55 89,60 88.95,60.05 | v78,57 81,60 88.9,60
  Bottom 0.305: v72,29 v68,29 | v76.5,32.8 78.2,32.8 v79,32
  Bottom 0.406: v78,57 77,56 v72,56
+10V  (via drill 0.4)
  Top 0.254: U5.1 68.55,53.95 68.8,53.7 68.8,52.3 68.55,52.05 U5.3
  Top 0.305: 58,53.7 58.1,53.8 | R5.2 48.35,64.2 55.7,64.2 56.8,63.1 60,63.1 62.5,60.6 62.5,53.4 61.5,52.4 55.3,52.4 55,52.7 55,53.8 | R20.2 7,28 8.5,26.5 13,26.5 13.5,26 14.5,26 15,26.5 15,33 13,35 13,41 v13.5,41.5 | v44,53 45,52
  Top 0.406: U5.3 66.16,52.05 C29.1 66,52.21 66,51 67.2,49.8 67.2,30.2 v66,29 | C11.1 54.1,54 | D4.A v69,16
  Top 0.61: U3.1 43.15,51.7 C6.1 44,51 45,52 46,53 53.9,53 C11.1 54.1,53.8 | C29.1 63.82,52.52 62.8,51.5 54.48,51.52 54,52 54,53.8
  Top 0.813: L2.2 58.1,53.8 55,53.8 C11.1 54,53.8
  Bottom 0.305: v13.5,41.5 13.5,42.5 17,46 23.5,46 25.5,48 31.3,48 34.8,51.5 42.5,51.5 v44,53
  Bottom 0.406: v69,16 67,16 66,17 v66,29
BAT+  (via drill 0.4)
  Top 0.305: U4.3 U4.4 | R10.2 69,48.4 69.7,49.1 71.4,49.1 72.9,50.6 72.9,57.1 72,58 65,58 64,59 64,61 60,65 46,65 45,64 45,59 46,58 47.2,58 48,57.2 48.27,57.2 48.6,56.88
  Top 0.406: U4.4 48.6,56.88 C10.1
  Top 0.61: L1.2 18.39,55 34,55 35,56 C10.1
  other vias: 16.5,7 15.5,6 15.5,4 16.5,3 18.5,3 19.5,4 19.5,6 18.5,7 6,49 6,47 6,45 6,51 6,43 6,41 6,39 8,51 8,49 7,50 7,48 7,46 7,52 8,53 8,47 9,46 9,48 9,50 9,52 7,44 8,45
  pour Top (no thermals): 17,54 7,54 5,52 5,39 8,36 8,28 9,27 14,27 15,28 15,33 13,35 13,42 14,43 16,43 17,44
  pour Bottom (no thermals): 14,2 20.5,2 21.5,3 21.5,20.5 15,27 15,43 13,45 13,75 12,76 1,76 1,18 13,6 13,3
  pour Top (no thermals): 14,2 20.5,2 21.5,3 21.5,15 20.5,16 14,16 13,15 13,3
BAT-  (via drill 0.4)
  Top 0.305: R8.2 37.5,19 38,18.5 38,17.8 40.7,15.1 40.7,2.3 41.9,1.1 60.1,1.1 61.8,2.8 61.8,15.4 62.36,15.96 U2.4 | v22,21 22,20.5 22.5,20 R9.1 | U7.5 66,23.7 65.7,24 v64.7,24
  Bottom 0.305: v22,21 23,20 34,20 41.3,12.7 41.3,2.7 42.4,1.6 59.6,1.6 61,3 61,23 62,24 v64.7,24
  other vias: 35.5,7 34.5,6 34.5,4 37.5,3 35.5,3 38.5,4 38.5,6 37.5,7 34,13 36,13 36,15 34,15 38,13
  pour Top (no thermals): 33,3 33,15 31,17 24,17 23,18 23,22 35,22 37,20 37,18 40,15 40,2 34,2
  pour Bottom (no thermals): 33.5,3 34.5,2 38.5,2 39.5,3 39.5,12.5 36,16 34.5,16 33.5,15
BAT-1  (via drill 0.4)
  Top 0.254: 4,29.95 4,28
  Top 0.305: R9.2 21.5,20 22,19.5 v22,19 | 4,28 5,27 7,27 8,26 12,26 14.31,23.69 Q5.3 | 4,29.95 T1.E 2.85,31.05 1.7,32.2 1.7,33.55 R21.1 | v64,23 65.3,23 U7.4
  Bottom 0.305: v22,19 34.1,19 40.7,12.4 40.7,2.3 41.9,1.1 60.1,1.1 61.8,2.8 61.8,22.5 62.3,23 v64,23
  pour Top (no thermals): 21,17 21,24 19,26 14,26 13,25 13,19 15,19 17,17
CAN_GND
  Top 0.406: R28.2 78,16 79,15 79,10 78.35,9.35 JP1.7
  Bottom 0.406: 86.09,8.1 JP2.3 | JP1.7 75,9.18 75,8 | JP1.3 70.09,7.91 70.5,7.5 74.5,7.5 75,8 | 75,8 75.5,7.5 85.5,7.5 86.09,8.1 | JP2.7 91.17,7.88 90.8,7.5 86.69,7.5 86.09,8.1
CAN_H
  Top 0.406: JP1.1 69.3,7.6 81.81,7.6 JP2.1 83.05,9.86 D3.1 83.05,19.25 83.64,19.84 | 83.64,19.84 U1.7 | S2.P$3 88.35,23.35 86,21 86,20.3 85.3,19.6 83.87,19.6 83.64,19.84
CAN_L  (via drill 0.4, 0.5)
  Top 0.406: U1.6 82.36,19.36 82,19 v82,18 | JP2.2 84.95,12.02 D3.2 86,16.95 v86,17 87.58,17 R25.1 | v81,15 82,14 v82,12
  Bottom 0.406: JP1.2 68.83,12.82 70,14 77,14 78,15 v81,15 | v82,18 85,18 v86,17 | v82,12 82.11,11.89 JP2.2
CAN_RX  (via drill 0.4)
  Top 0.254: U1.4 81.09,25.5 81.6,25 85.3,25 85.8,25.5 v85.8,35.2 | U6.45 83.34,41.24 83.1,41 83.1,39.7 v82.8,39.4
  Bottom 0.254: v85.8,35.2 83.2,37.8 83.2,39 v82.8,39.4
CAN_SHLD  (1 unrouted)
CAN_TX  (via drill 0.4)
  Top 0.254: U1.1 85,26.8 85,34.8 84.1,35.7 v83.6,35.7 | v82.3,38 82.3,38.2 82.1,38.4 82.1,40.9 82.95,41.75 U6.46
  Bottom 0.254: v83.6,35.7 82.3,37 v82.3,38
CAN_V+
  Top 0.406: D4.C 73.58,14.43 74,14 76,14 76.4,13.6 76.4,11.94 JP1.8
  Bottom 0.406: JP1.8 78.56,14 91,14 92.44,12.55 JP2.8
DCDC_IN  (via drill 0.4, 0.5)
  Top 0.305: 44,39 43,40 43,43.5 44.5,45 46,45 46.5,45.5 D2.A 48.38,46.58 Q7.1 | 44,39 Q3.4 | 45.46,31 C18.+ | v47,36 44,39 | v69,41 R12.2
  Bottom 0.305: v69,41 66,41 65,40 65,35 64,34 57,34 54,37 48,37 v47,36
  pour Top (no thermals): 28,42 46,42 47,41 47,37 48,36 48,30 47,29 29,29 28,30 28,38 27,39 27,41
FUSE+  (via drill 0.4)
  other vias: 26,7 28,7 29,6 29,4 28,3 26,3 25,4 25,6
  pour Bottom (no thermals): 22.5,3 22.5,18.5 32.5,18.5 32.5,3 31.5,2 23.5,2
  pour Top (no thermals): 22.5,3 23.5,2 31,2 32,3 32,15 31,16 22.5,16
GND  (via drill 0.4)  (2 unrouted)
  Top 0.254: C26.2 75.9,34.45 | C27.2 78.9,30.65 v78.9,29.5 | v80.2,33.9 C30.2 81.35,33.95 82.26,34.86 U6.35 | U6.47 85.26,42.26 86,43 86,43.95 C24.2 87.05,45 v88,45 | R32.1 90.05,59.85 v89.9,59.7 | v88,65 C23.2 | SWD.5 SWD.3 89.73,66.27 v89,67 | U6.23 76.66,37.74 76.8,37.6 76.8,36.9 76.15,36.25 C26.2 | LED6.C 77.27,73.39 LED3.K | 66.88,74.61 LED1.K | v75.6,33.6 76.15,34.15 C26.2 | U6.8 79.24,45.46 78.9,45.8 78.4,45.8 77.6,46.6 77.6,47.45 C21.2 | v77.6,49.3 77.4,49.3 76.7,48.6 | v82.7,48.4 82.1,49 81.3,49 80.8,49.5 80.8,49.9 80.4,50.3 79.9,50.3 79.4,50.8 79.4,52.5 80.15,53.25 C32.2 80.2,53.3 80.8,53.9 80.8,57 81.6,57.8 85.9,57.8 86.7,57 86.7,53.75 C31.2 | v84.9,48.4 85.5,49 86.4,49 86.9,49.5 86.9,50.1 87.3,50.5 87.9,50.5 88.3,50.9 88.3,52.2 87.5,53 | 79.6,48.72 79.02,49.3 v78.9,49.3 | v81,68 82.35,68 R31.1
  Top 0.305: C9.2 53.8,62.65 v53.8,58.6 | U4.8 55.25,62.15 54.7,62.7 C9.2 | C9.2 52.95,63.6 49.75,63.6 R6.1 | R8.1 39,19 38.5,18.5 38.5,18 41.3,15.2 41.3,2.7 42.4,1.6 59.6,1.6 61,3 61,16 62,17 65.7,17 66,16.7 U2.5 | R13.1 C16.2 v73,41 | 66.88,74.61 LED4.C | LED2.K 71.88,74.61 LED5.C | U7.2 66,26.15 C20.2 v68,27 | U2.2 66,19.15 C17.2 v68,20 | v77,22 C19.2 75.35,23.15 74.91,22.7 IC1.4 | R30.1 71.15,18 v71,18 | U1.2 83.64,28.79 C22.2 83.8,29.05 v83.8,30.3 | R26.2 v87,34 | C14.2 70,37.85 v70,36.5 70,35.15 C15.2 | v73,49 C12.2 R11.1
  Top 0.406: 53.95,59.05 v53.8,58.6 | R28.1 75.15,17 v75,17 | D3.3 85.1,18.1 v86,19
  Bottom 0.305: 65,34 68,34
  other vias: 22.5,35 52.7,58.6 20,27 21,26 22,25 21,27 22,27 22,26 23,25 23,26 23,27 45,7 47,7 48,6 48,4 47,3 45,3 44,4 44,6 41,48.5 42,48.5 22.5,37 22.5,36 22.5,34 26,33 26,34 16.5,33 16.5,34 17.5,33 66,56 67,56 79.1,42.9
  pour Bottom: 34,81 99,81 99,1 66,1 66,44 59,50 36,50 34,52
  pour Top (no thermals): 27,38 27,29 28,28 47,28 48,27 48,14 50,12 50,3 49.2,2.2 42.8,2.2 42,3 42,15.5 39.5,18 39.5,21.5 38,23 23,23 19,27 17,27 16,28 16,32.7 14,34.7 14,38
  pour Bottom (no thermals): 15.7,27.3 24,19 36,19 42,13 42,3 42.8,2.2 49.2,2.2 50,3 50,12 48,14 48,23 50,25 64,25 65,26 65,34 57,34 54,37 48,37 47,38 47,48 46,49 34,49 32,47 26,47 24,45 18,45 16,43 15.7,37
  pour Top (no thermals): 52.5,59.2 56,59.2 56,55.2 53,55.2 52.3,54.5 50.6,54.5 50.6,57.3
  pour Top (no thermals): 40,50 45,50 45,47 42,47 42,46 40,46
  pour Top (no thermals): 65,53 65,56 66,57 69,57 69,55 68,54 68,53
HS_DRV
  Top 0.406: R2.1 39,50 39.37,50.37 U3.3
I2C1_SCL
  Top 0.254: U6.42 87.98,39.75 91.23,43 UEXT.5 92.4,43 93.7,41.7 95.7,41.7 96.3,42.3 96.3,57.42 R48.1
I2C1_SDA
  Top 0.254: U6.43 87.25,40.25 91.3,44.3 92.97,44.3 UEXT.6 95.7,44.43 95.7,56.3 93.85,58.15 R45.1
I_DCDC
  Top 0.254: C15.1 72,35 74,37 74,40 74.76,40.76 U6.17
  Top 0.305: R16.2 C15.1
I_LOAD
  Top 0.254: C14.1 73.02,38 73.4,38.38 73.4,40.3 74.36,41.26 75.77,41.26 U6.16
  Top 0.305: C14.1 R17.2
LC_OUT  (via drill 0.4)
  Top 0.305: C13.2 R7.1 53,42
  other vias: 61,42 50,39.5 51,39.5 52,39.5 60,42 59,42 62,42 63,36 62,36 61,36 60,36 59,36 63,42 50,43 51,43 52,43 49,39.5
  pour Top (no thermals): 49,38 54,38 57,35 63,35 64,36 64,42.5 63,43.5 49,43.5 48,42.5 48,39
  pour Bottom: 54,38 57,35 63,35 64,36 64,42.5 63,43.5 49,43.5 48,42.5 48,39 49,38
LED1  (via drill 0.4)
  Top 0.254: U6.30 79.75,36.75 79.6,36.9 78.7,36.9 v78.2,37.4 | v76.1,44.1 76.1,44.4 74.7,45.8 74.7,49.6 74,50.3 74,66 71,69 68,69 67,70 67,70.85 R15.2
  Bottom 0.254: v78.2,37.4 78.2,38.6 76.4,40.4 76.4,43.8 v76.1,44.1
LED2  (via drill 0.4)
  Top 0.254: U6.31 80.25,36.85 v79.4,37.7 | v75.5,46.3 75.2,46.6 75.2,49.9 74.5,50.6 74.5,67.5 71.85,70.15 R24.2
  Bottom 0.254: v79.4,37.7 79.4,38 76.9,40.5 76.9,44.3 75.5,45.7 v75.5,46.3
LED3  (via drill 0.4)
  Top 0.254: U6.25 77.26,38.26 v77.3,38.3 | v75.1,43.5 75,43.6 75,44.5 74.1,45.4 74.1,49.4 73.5,50 73.5,64.5 v73,65 | v76,68 76.85,68.85 R33.2
  Bottom 0.254: v77.3,38.3 75.9,39.7 75.9,42.6 75.1,43.4 v75.1,43.5 | v73,65 v76,68
LOAD-  (via drill 0.4)
  other vias: 9,7 10,6 10,4 9,3 7,3 6,4 6,6 7,7
  pour Top (no thermals): 4,2 11,2 12,3 12,25 11,26 4,26 3,25 3,3
  pour Bottom (no thermals): 10,2 11,3 11,7 10,8 6,8 5,7 5,3 6,2
LOAD_EN  (via drill 0.4)
  Top 0.254: 64,50 66.2,47.8 v66.2,32.6 | v73,32 73,35 74.6,36.6 74.6,38.9 74.94,39.24 U6.20
  Top 0.305: R23.1 7,32 8,31 8,28 9,27 v14,27 | v46,51 49,51 50,50 64,50
  Bottom 0.254: v66.2,32.6 66.8,32 v73,32
  Bottom 0.305: v14,27 15,28 15,43 17.5,45.5 24,45.5 26,47.5 31.6,47.5 34.8,50.7 45.7,50.7 v46,51
LOAD_G  (1 unrouted)
  Top 0.305: 3,28.85 3,28 4.5,26.5 6.5,26.5 7.5,25.5 11.5,25.5 12,25 12,19 12.28,18.72 Q5.1
LS_DRV
  Top 0.406: 41.95,46.26 U3.8 41.91,44.91 41,44 R3.1
N$1
  Top 0.406: R1.1 40.63,53.52 U3.2
N$2
  Top 0.406: R1.2 36.25,54.1 C5.1
N$3
  Top 0.305: R26.1 87,23 85.3,21.3 U1.8
N$4  (via drill 0.4)
  Top 0.305: Q1.1 36.09,44.5 v40,44.5 | v41.5,43 43,44.5 43,46 43.58,46.58 D1.A
  Top 0.406: R2.2 34.05,46.08 Q1.1
  Bottom 0.305: v40,44.5 v41.5,43
N$5
  Top 0.406: R25.2 91.93,23.35 S2.P$2
N$6
  Top 0.254: IC1.6 IC1.7
N$7
  Top 0.254: R27.1 82.6,47 81.25,45.65 U6.4
N$8
  Top 0.305: Q3.1 50.03,37 48,37 47.5,37.5 47.5,42 49.5,44 50.5,44 50.8,44.3 Q7.3 52.65,46 R7.2 C13.1
N$9
  Top 0.406: R3.2 26.8,43 25.5,41.7 25.5,39.6 24.9,39 20.4,39 19.72,38.32 Q2.1
N$10
  Top 0.305: D1.C D2.C 47.58,43.42 Q7.2
N$11
  Top 0.305: R22.1 6.2,30.35 R20.1 7,31 6,32 T1.C
N$12
  Top 0.406: R4.2 R14.2 14.7,41.35 C7.2
N$13
  Top 0.305: U4.6 58.62,59.67 L2.1 58.85,59.45 C8.2
N$14
  Top 0.305: U4.7 56.08,60.33 C8.1
N$15
  Top 0.254: R27.2 84.1,47.35 84.1,49.08 X1.1 85.86,50.21 C31.1
N$16
  Top 0.305: C9.1 52,62.55 52,60.7 51.62,60.33 U4.2
N$17
  Top 0.254: U6.3 81.75,45.55 82.1,45.9 83.3,45.9 83.6,46.2 83.6,49.1 82.49,50.21 X1.4 81.54,50.21 C32.1
N$18
  Top 0.305: U2.6 66.96,15.96 70,19 70,32.85 R16.1
N$19  (via drill 0.4)
  Top 0.254: IC1.5 75.31,27 v76,27 | v74,24 73.64,23.64 IC1.3
  Top 0.305: R29.1 R30.2 73.64,19.21 IC1.3
  Bottom 0.254: v76,27 74,25 v74,24
N$20
  Top 0.305: U7.6 67.96,22.96 69,24 69,39.5 69.5,40 R17.1
N$22
  Top 0.305: U4.1 49.17,60.98 R6.2 R5.1
N$24
  Top 0.305: R23.2 6.65,35 R21.2 4.85,33.85 4.5,33.5 3.45,33.5 T1.B
N$27
  Top 0.254: R18.2 86.65,70.1 K1.2
N$28
  Top 0.254: R19.2 86,71.15 K1.3
N$29
  Top 0.254: R31.2 83.75,71.1 84.7,71.1 85.35,71.75 K1.4
N$30  (via drill 0.4)
  Top 0.254: U6.44 85.36,40.76 85.7,41.1 85.7,41.9 86.7,42.9 87.4,42.9 89.6,45.1 89.6,46.8 v90,47.2 | v90,49.1 90,49.4 93.27,52.67 JP4.1 93.27,55.98 R32.2
  Bottom 0.254: v90,47.2 v90,49.1
N$35
  Top 0.254: LED3.A 75.12,74.61 LED6.A 75.12,71.03 R33.1
N$43
  Top 0.305: LED1.A 65.12,74.61 LED4.A 65.15,72.97 R15.1
N$46
  Top 0.305: LED2.A 70.12,74.61 LED5.A 70.15,72.97 R24.1
OSC_IN
  Top 0.254: U6.5 80.76,46.65 80.8,46.68
OSC_OUT
  Top 0.254: U6.6 80.25,45.75 80,46 79.4,46 79.1,46.3 78.78,46.3 78.4,46.68
SOLAR+  (via drill 0.4)
  other vias: 57.5,4 57.5,6 56.5,7 54.5,7 53.5,6 53.5,4 54.5,3 56.5,3 56,23 59,22 56,22 56,21 56,20 56,19 59,20 50,19 50,20 50,21 50,22 50,23 59,6 59,8 59,10 59,12 59,14 59,16 59,18
  pour Top (no thermals): 52,2 51,3 51,12 49,14 49,23 50,24 59,24 60,23 60,3 59,2
  pour Bottom (no thermals): 52,2 51,3 51,12 49,14 49,23 50,24 59,24 60,23 60,3 59,2
SPI1_MISO
  Top 0.254: UEXT.7 90.03,38.76 U6.40
SPI1_MOSI
  Top 0.254: UEXT.8 93.03,41.7 90.9,41.7 88.44,39.24 U6.41
SPI1_SCK
  Top 0.254: UEXT.9 91.4,38.25 U6.39
SSEL  (via drill 0.4)
  Top 0.254: UEXT.10 92.95,36.6 88.5,36.6 v87.7,37.4 | U6.11 77.74,43.06 78.6,42.2 79.4,42.2 v80.3,41.3
  Bottom 0.254: v87.7,37.4 85,37.4 84.4,38 84.4,39.2 82.9,40.4 81.2,40.4 v80.3,41.3
SW_NODE  (via drill 0.4)
  Top 0.406: C7.1 21.41,42 Q2.4 | U3.4 36.45,51.7 C5.2 30.7,52.15 L3.P$2
  other vias: 26.5,52.5 26.5,51.5 26.5,50.5 26.5,49.5 27.5,53.5
  pour Top (no thermals): 18,40 26,40 26,43 33,43 33,53 32,54 19,54 18,53
  pour Bottom (no thermals): 27,54 32,54 33,53 33,49 32,48 27,48 26,49 26,53
SWCLK
  Top 0.254: SWD.4 96.73,66.27 97.3,65.7 97.3,36.4 96.9,36 88,36 86.74,37.26 U6.37
SWDIO
  Top 0.254: SWD.2 97.06,67.54 98,66.6 98,36 97,35 88,35 86.3,36.7 83.3,36.7 83,37 82.1,37 81.75,36.65 U6.34
TIM1_CH1  (via drill 0.4)
  Top 0.254: v73,30 76,30 79.24,33.24 U6.29
  Top 0.305: U3.5 38.09,48.41 v37.5,49 | v48,50 48,49 49,48 63,48 64.7,46.3 v64.7,30
  Bottom 0.254: v64.7,30 v73,30
  Bottom 0.305: v37.5,49 38.5,50 v48,50
TIM1_CH1N  (via drill 0.4)
  Top 0.305: U3.6 39.37,48.63 v39,49 | v49.4,49 63,49 65.4,46.6 65.4,31.4 65.8,31 v65.9,31 | v71,31 76,31 77.74,32.74 U6.26
  Bottom 0.305: v39,49 39.5,49.5 47.2,49.5 47.7,49 v49.4,49 | v65.9,31 v71,31
USART2_RX  (via drill 0.4)
  Top 0.254: UEXT.4 93.01,46.8 90.9,46.8 90.3,46.2 90.3,44.9 87.3,42 v86.9,42 | v78.7,41 78.4,41 76.66,42.74 U6.13
  Bottom 0.254: v86.9,42 79.7,42 v78.7,41
USART2_TX  (via drill 0.4)
  Top 0.254: UEXT.3 87.1,40.9 86.6,40.9 v86.5,41 | v81.4,41.3 81.4,40.8 81.1,40.5 80,40.5 79.5,41 79.5,41.3 79.1,41.7 78.4,41.7 77.26,42.84 U6.12
  Bottom 0.254: v86.5,41 81.7,41 v81.4,41.3
USB_DM  (via drill 0.4)
  Top 0.254: U6.32 80.76,37.74 v80.1,38.4 | R18.1 86.9,65.9 85,64 79.2,64 75,59.8 75,51.7 v76.1,50.6
  Bottom 0.254: v80.1,38.4 79.6,38.4 77.4,40.6 77.4,44.5 76.2,45.7 76.2,50.5 v76.1,50.6
USB_DP  (via drill 0.4)
  Top 0.254: U6.33 81.25,38.26 v79.8,39.7 | v84,65 84.7,65.7 R19.1 | v82,63 81,63 75.5,57.5 75.5,52.9 v76.9,51.5
  Bottom 0.254: v79.8,39.7 78.9,39.7 77.9,40.7 77.9,44.7 76.7,45.9 76.7,50 76.9,50.2 v76.9,51.5 | v82,63 v84,65
V_BAT
  Top 0.254: U6.14 74.84,42.26 74.4,42.7 74.4,44.3 73.7,45 73.3,45 73,45.3 C12.1
  Top 0.305: C12.1 R11.2 R10.1
V_SOLAR
  Top 0.254: C16.1 73.9,42.95 73.9,42.3 74.45,41.75 U6.15
  Top 0.305: 73,44 C16.1 R13.2 R12.1
VREF  (via drill 0.4)
  Top 0.305: IC1.2 IC1.1 71,21.5 v71,23.6 | v67.7,24 67.2,24 66.7,24.5 66.7,25 U7.1 | U2.1 67.44,18.04 v68,18.6
  Bottom 0.305: v71,23.6 70.6,24 v67.7,24 67.2,24 67,23.8 67,19.1 67.5,18.6 v68,18.6

### Text on the board
tPlace: Libre Solar / MPPT charger | Design: Martin Jäger / www.libre.solar | CC BY-SA | Made in Fabulous / St. Pauli | TERMINATION | OFF | V0.5 (06/2016)
tNames: - + | + - | - +
bNames: - | + | + | - | - | +